# Altium schematic sheet block diagram.SchDoc
size A3; DocumentNumber: 3; Revision: V1.0; SheetNumber: 3; SheetTotal: 11; Stage: DRAFT
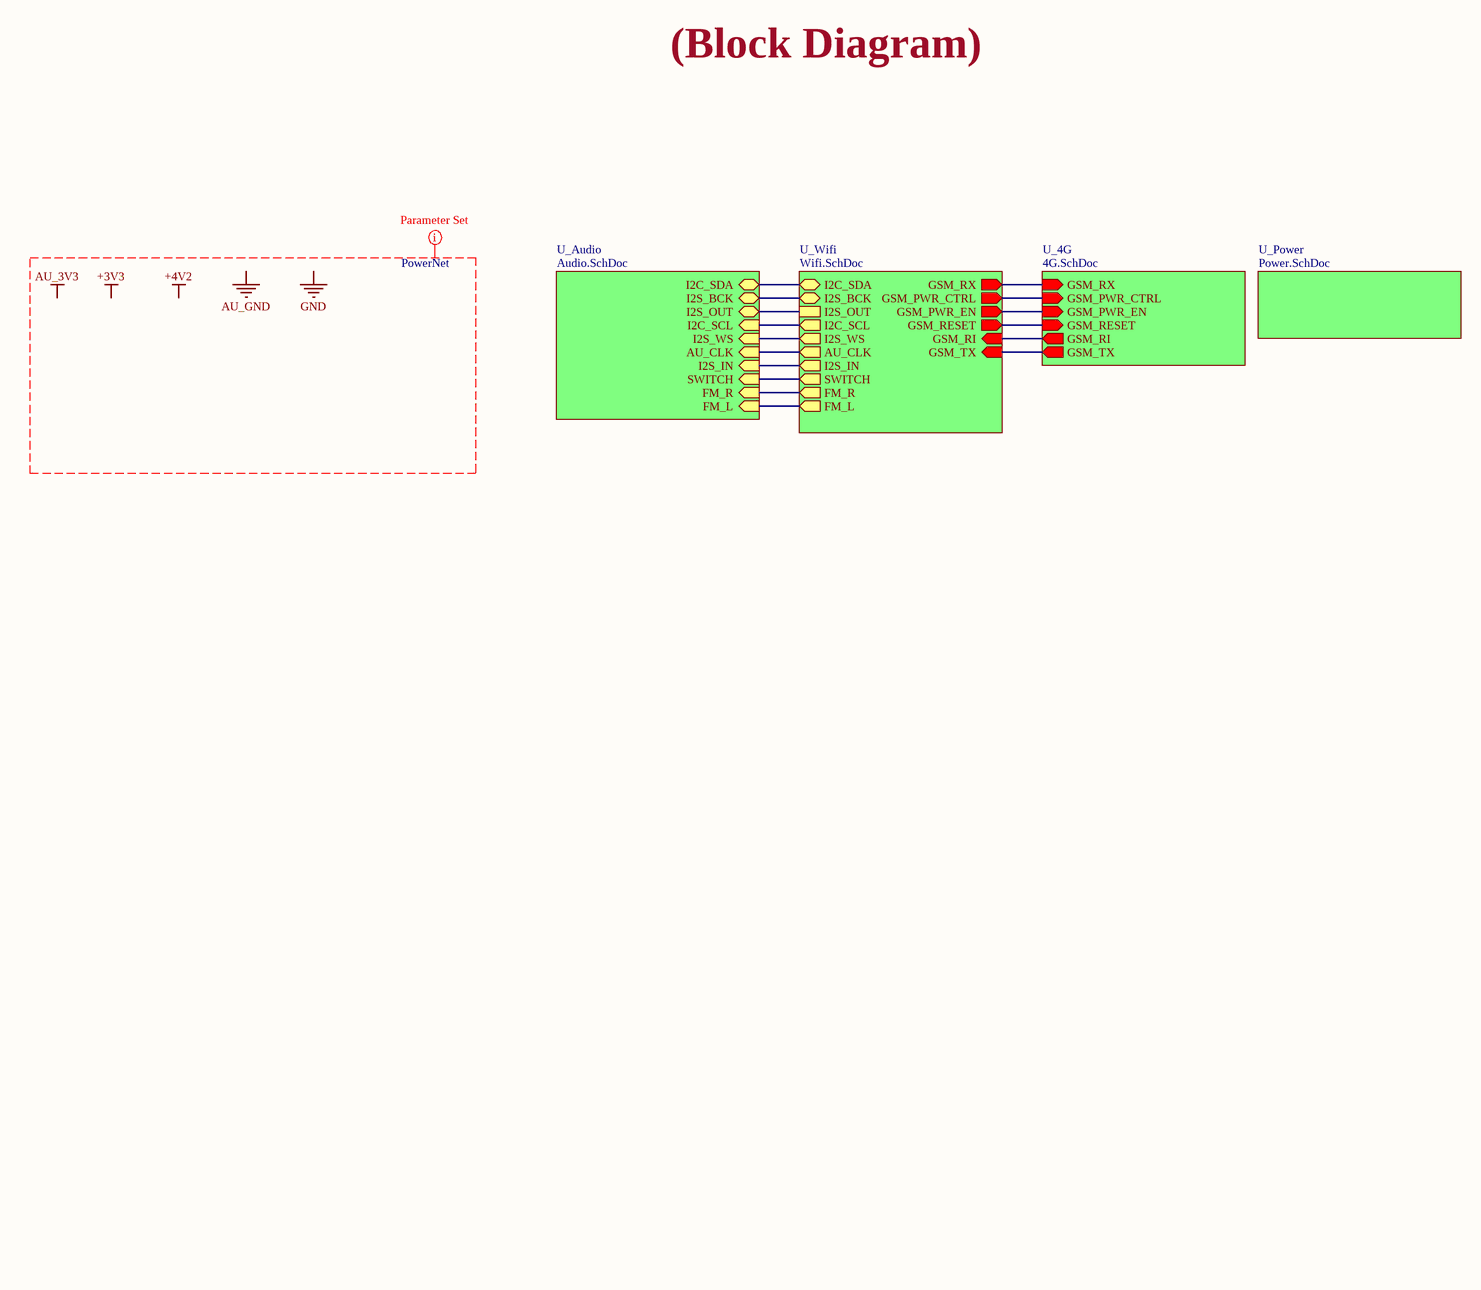
[diagram p0: block diagram.SchDoc]

## Sub-sheets
U_4G = 4G.SchDoc: GSM_PWR_EN (in), GSM_RESET (in), GSM_PWR_CTRL (in), GSM_RX (in), GSM_TX (out), GSM_RI (out)
U_Audio = Audio.SchDoc: I2C_SCL (in), I2C_SDA (bidir), I2S_BCK (bidir), I2S_WS (in), I2S_IN (in), I2S_OUT (bidir), AU_CLK (in), SWITCH (in), FM_L (in), FM_R (in)
U_Power = Power.SchDoc: no entries
U_Wifi = Wifi.SchDoc: I2C_SCL (out), I2C_SDA (bidir), I2S_BCK (bidir), I2S_OUT, I2S_WS (out), I2S_IN (out), GSM_RX (out), GSM_TX (in), GSM_RI (in), AU_CLK (out), FM_L (out), FM_R (out), GSM_PWR_CTRL (out), GSM_PWR_EN (out), GSM_RESET (out), SWITCH (out)

## Nets
(unnamed): sheet U_4G/GSM_PWR_EN, sheet U_Wifi/GSM_PWR_EN
(unnamed): sheet U_4G/GSM_RESET, sheet U_Wifi/GSM_RESET
(unnamed): sheet U_4G/GSM_PWR_CTRL, sheet U_Wifi/GSM_PWR_CTRL
(unnamed): sheet U_4G/GSM_RX, sheet U_Wifi/GSM_RX
(unnamed): sheet U_4G/GSM_TX, sheet U_Wifi/GSM_TX
(unnamed): sheet U_4G/GSM_RI, sheet U_Wifi/GSM_RI
(unnamed): sheet U_Wifi/I2C_SCL, sheet U_Audio/I2C_SCL
(unnamed): sheet U_Wifi/I2C_SDA, sheet U_Audio/I2C_SDA
(unnamed): sheet U_Wifi/I2S_BCK, sheet U_Audio/I2S_BCK
(unnamed): sheet U_Wifi/I2S_OUT, sheet U_Audio/I2S_OUT
(unnamed): sheet U_Wifi/I2S_WS, sheet U_Audio/I2S_WS
(unnamed): sheet U_Wifi/I2S_IN, sheet U_Audio/I2S_IN
(unnamed): sheet U_Wifi/AU_CLK, sheet U_Audio/AU_CLK
(unnamed): sheet U_Wifi/FM_L, sheet U_Audio/FM_L
(unnamed): sheet U_Wifi/FM_R, sheet U_Audio/FM_R
(unnamed): sheet U_Wifi/SWITCH, sheet U_Audio/SWITCH

## Layout directives
net class PowerNet: +3V3, +4V2, AU_3V3, AU_GND, GND

## Notes on the sheet
- (Block Diagram)
- CLOCKS (CPU & PCIE)
- Labels drawn without touching a wire or pin: +3V3, +4V2, AU_3V3, AU_GND, GND
- Project:
- File:
- Size
- Rev
- A3
- Sheet
- /
- Drawn by:
- Checked by:
- Approved by: